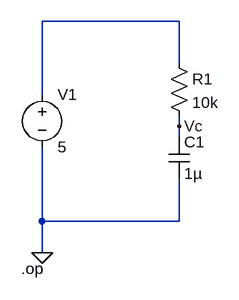
[diagram p0: schematic T2_1_RC_op.asc]
T2_1_RC_op.asc, the LTspice schematic file:
Version 4
SHEET 1 880 680
WIRE 352 -32 144 -32
WIRE 352 32 352 -32
WIRE 144 80 144 -32
WIRE 352 128 352 112
WIRE 352 144 352 128
WIRE 144 272 144 160
WIRE 352 272 352 208
WIRE 352 272 144 272
WIRE 144 320 144 272
FLAG 144 320 0
FLAG 352 128 Vc
SYMBOL voltage 144 64 R0
WINDOW 123 0 0 Left 0
WINDOW 39 0 0 Left 0
SYMATTR InstName V1
SYMATTR Value 5
SYMBOL cap 336 144 R0
SYMATTR InstName C1
SYMATTR Value 1µ
SYMBOL res 336 16 R0
SYMATTR InstName R1
SYMATTR Value 10k
TEXT 112 344 Left 2 !.op

The netlist it stands for:
* T2_1_RC_op.asc
V1 N001 0 5
C1 Vc 0 1µ
R1 N001 Vc 10k
.op
.backanno
.end